# Altium schematic sheet 2_LDO.SchDoc: LDO
size A4; ApprovedBy: Alcatraz; CheckedBy: Alcatraz; Author: Alcatraz; CompanyName: DHNLAB; DrawnBy: Alcatraz; Engineer: Alcatraz; Organization: DHNLAB PVT LTD; Address1: DHANBAD; Address2: JHARKHAND; Address3: INDIA; Address4: ASIA; DocumentNumber: 2; Revision: 1.0; SheetNumber: 2; SheetTotal: 10; ProjectTitle: ESP8266-Deskop_Power
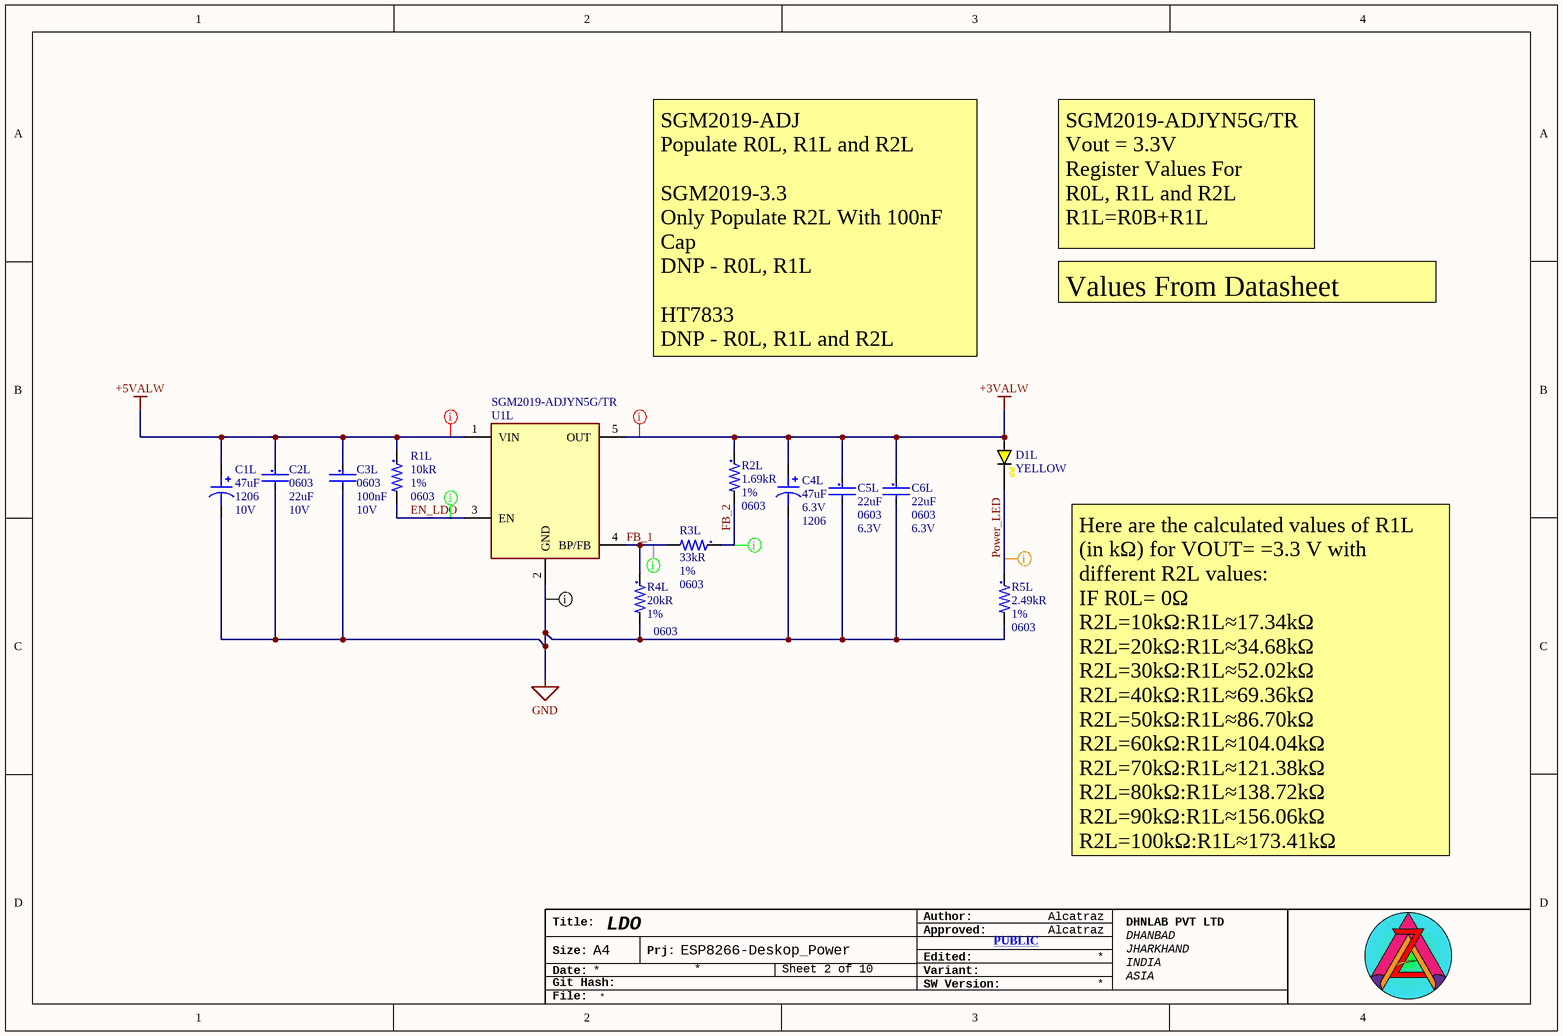
[diagram p0: 2_LDO.SchDoc]

## Parts
C1L  value 47uF  Case/Package: 1206  Voltage Rating (DC): 10V  [CAP POL 1206_3216-MFG]  (hidden comment: TCTAL1A476M8R)
C2L  value 22uF  Case/Package: 0603  Voltage Rating: 10V  [C0603-IPC_C_No_Silk]  (hidden comment: GRM188R61A226ME15D)
C3L  value 100nF  Case/Package: 0603  Voltage Rating: 10V  [C0603-IPC_C_No_Silk]  (hidden comment: C0603C104K8RACTU)
C4L  value 47uF  Voltage: 6.3V  Size: 1206  [CAP POL 1206_3216-MFG]  (hidden comment: T491A476M006AT)
C5L  value 22uF  Case/Package: 0603  Voltage Rating: 6.3V  [C0603-IPC_C_No_Silk]  (hidden comment: GRM188R60J226MEA0D)
C6L  value 22uF  Case/Package: 0603  Voltage Rating: 6.3V  [C0603-IPC_C_No_Silk]  (hidden comment: GRM188R60J226MEA0D)
D1L  YELLOW  [LED_0603_YELLOW]
R1L  value 10kR  Tolerance: 1%  Case/Package: 0603  [R0603-MFG]  (hidden comment: RC0603FR-0710KL)
R2L  value 1.69kR  Tolerance: 1%  Case/Package: 0603  [R0603-MFG]  (hidden comment: MCR03EZPFX1691)
R3L  value 33kR  Tolerance: 1%  Case/Package: 0603  [R0603-MFG]  (hidden comment: ERJ-3EKF3302V)
R4L  value 20kR  Tolerance: 1%  Case/Package: 0603  [R0603-MFG]  (hidden comment: CR0603-FX-2002ELF)
R5L  value 2.49kR  Tolerance: 1%  Case/Package: 0603  [R0603-MFG]  (hidden comment: MCR03EZPFX2491)
U1L  SGM2019-ADJYN5G/TR  [TSOT-23-5-IPC-A]

## Nets
+3VALW: C4L.1 C5L.1 C6L.1 D1L.2(A) R2L.1 U1L.5(OUT)
+5VALW: C1L.1 C2L.1 C3L.1 R1L.1 U1L.1(VIN)
GND: C1L.2 C2L.2 C3L.2 C4L.2 C5L.2 C6L.2 R4L.2 R5L.2 U1L.2(GND)
EN_LDO: R1L.2 U1L.3(EN)
FB_1: R3L.2 R4L.1 U1L.4(BP/FB)
FB_2: R2L.2 R3L.1
Power_LED: D1L.1(K) R5L.1

## Layout directives
net class GND; net class PowerRails_GND: GND
net class Power; net class PowerRails_LowVoltage_DC; net class Power_Signal: Power_LED
net class Digital_Signal_Low_Speed; net class Signal: EN_LDO, FB_1, FB_2
net class Power; net class PowerRails_LowVoltage_DC: +3VALW, +5VALW

## Notes on the sheet
- SGM2019-ADJYN5G/TR
  Vout = 3.3V
  Register Values For
  R0L, R1L and R2L
  R1L=R0B+R1L
- Values From Datasheet
- SGM2019-ADJ
  Populate R0L, R1L and R2L
  SGM2019-3.3
  Only Populate R2L With 100nF Cap
  DNP - R0L, R1L
  HT7833
  DNP - R0L, R1L and R2L
- Here are the calculated values of R1L (in kΩ) for VOUT= =3.3 V with different R2L values:
  IF R0L= 0Ω
  R2L=10kΩ:R1L≈17.34kΩ
  R2L=20kΩ:R1L≈34.68kΩ
  R2L=30kΩ:R1L≈52.02kΩ
  R2L=40kΩ:R1L≈69.36kΩ
  R2L=50kΩ:R1L≈86.70kΩ
  R2L=60kΩ:R1L≈104.04kΩ
  R2L=70kΩ:R1L≈121.38kΩ
  R2L=80kΩ:R1L≈138.72kΩ
  R2L=90kΩ:R1L≈156.06kΩ
  R2L=100kΩ:R1L≈173.41kΩ
- Title:
- Author:
- Approved:
- Size:
- Date:
- Git Hash:
- A4
- Prj:
- SW Version:
- Variant:
- Edited:
- PUBLIC
- File:

## Library data of the parts
C1L = 47uF_10V: Surface Mount Tantalum Capacitor, 47 uF, 10 V, ± 20%, -55 °C, 125 °C, 1206 [3216-12 Metric]; Manufacturer: Rohm; Supplier 1: Ameya360; RoHS: Yes; Category: Tantalum Capacitors; ComponentLink1URL: https://datasheet.ciiva.com/258/tct-al-258880.pdf?src-supplier=Digikey; ComponentLink1Description: https://datasheet.ciiva.com/258/tct-al-258880.pdf?src-supplier=Digikey; ComponentLink2URL: https://datasheet.ciiva.com/258/tct-al-258881.pdf?src-supplier=Digikey; ComponentLink2Description: https://datasheet.ciiva.com/258/tct-al-258881.pdf?src-supplier=Digikey; ComponentLink3URL: https://datasheet.ciiva.com/258/tct-al-258879.pdf?src-supplier=Digikey; ComponentLink3Description: https://datasheet.ciiva.com/258/tct-al-258879.pdf?src-supplier=Digikey; ComponentLink4URL: https://datasheet.ciiva.com/16394/tct-al-16394319.pdf?src-supplier=Future+Electronics; ComponentLink4Description: https://datasheet.ciiva.com/16394/tct-al-16394319.pdf?src-supplier=Future+Electronics; Manufacturer Part Number: TCTAL1A476M8R; Stock 1: 250; Pricing 1: 1=0.82, 10=0.622 (USD); Supplier Part Number 1: TCTAL1A476M8R; Mounting Technology: Surface Mount; Case Code (Metric): 3216; Case Code (Imperial): 1206; Min Operating Temperature: -55°C; Max Operating Temperature: 125°C; Tolerance: 20%; Packaging: Cut Tape; Voltage Rating: 10V; Series: TCT; Features: General Purpose; Construction: Flat; Length: 3.2mm; Height: 1.1mm; Depth: 1.6mm; Radiation Hardening: No; RoHS Compliant: Yes; Lead Free: Lead Free
C2L = 22uF_10V: Multilayer Ceramic Capacitor, 22 uF, 10 V, ± 20%, X5R, 0603 [1608 Metric]; Manufacturer: Murata; Supplier 1: Mouser; Manufacturer Part Number: GRM188R61A226ME15D; RoHS: Yes; Category: Ceramic Capacitors; Pricing 1: 1=0.2, 10=0.088, 50=0.088, 100=0.051, 1000=0.041, 10000=0.037 (USD); Mounting Technology: Surface Mount; Case Code (Imperial): 0603; Case Code (Metric): 1608; Min Operating Temperature: -55°C; Max Operating Temperature: 85°C; Packaging: Cut Tape; Dielectric: X5R; Package Quantity: 4000; Series: GRM; Termination: SMD/SMT; Voltage Rating (DC): 10V; Length: 1.6mm; Width: 0.8mm; Height: 0.8mm; RoHS Compliant: Yes; Lead Free: 5697LeadFree; ComponentLink1URL: https://datasheet.ciiva.com/46444/1769893-46444975.pdf?src-supplier=Element14; ComponentLink1Description: https://datasheet.ciiva.com/46444/1769893-46444975.pdf?src-supplier=Element14; Supplier Part Number 1: 81-GRM188R61A226ME5D; Tolerance: 20%; Stock 1: 596743; Material: Ceramic; Weight: 0.000222oz; Thickness: 0.039inch; Reach SVHC Compliant: No
C3L = 100nF_10V: Multilayer Ceramic Capacitor, 0.1 uF, 10 V, ± 10%, X7R, 0603 [1608 Metric]; Manufacturer: KEMET; Material: 4241ConductorMaterial; Dissipation Factor: 5%; Temperature Coefficient: 30ppm/°C; Supplier 1: Mouser; Manufacturer Part Number: C0603C104K8RACTU; RoHS: Yes; Category: Ceramic Capacitors; Pricing 1: 1=0.11, 10=0.075, 50=0.075, 100=0.036, 1000=0.021, 10000=0.017 (USD); Mounting Technology: Surface Mount,PCB; Case Code (Imperial): 0603; Case Code (Metric): 1608; Min Operating Temperature: -55°C; Max Operating Temperature: 125°C; Packaging: Tape and Reel; Dielectric: X7R; Package Quantity: 1; Series: C; Termination: SMD/SMT; Voltage Rating (DC): 10V; Length: 1.6mm; Width: 0.031inch; Height: 0.8mm; RoHS Compliant: Yes; Lead Free: 5697LeadFree; ComponentLink1URL: https://datasheet.ciiva.com/6093/1776114-6093269.pdf?src-supplier=Farnell; ComponentLink1Description: https://datasheet.ciiva.com/6093/1776114-6093269.pdf?src-supplier=Farnell; Supplier Part Number 1: 80-C0603C104K8R; Tolerance: 10%; Stock 1: 246409; Thickness: 0.034inch; Reach SVHC Compliant: No; Pins: 2; Dielectric Material: Ceramic; Voltage: 10V; Construction: Flat; Depth: 0.8mm; ComponentLink2URL: https://datasheet.ciiva.com/7823/kem-c1002-x7r-smd-7823989.pdf?src-supplier=Element14; ComponentLink2Description: https://datasheet.ciiva.com/7823/kem-c1002-x7r-smd-7823989.pdf?src-supplier=Element14; ComponentLink3URL: https://datasheet.ciiva.com/22693/1851736-22693967.pdf?src-supplier=Element14; ComponentLink3Description: https://datasheet.ciiva.com/22693/1851736-22693967.pdf?src-supplier=Element14; ComponentLink4URL: https://datasheet.ciiva.com/14589/70095383-14589402.pdf?src-supplier=Allied+Electronics; ComponentLink4Description: https://datasheet.ciiva.com/14589/70095383-14589402.pdf?src-supplier=Allied+Electronics; ComponentLink5URL: https://datasheet.ciiva.com/14593/70095383-14593978.pdf?src-supplier=Allied+Electronics; ComponentLink5Description: https://datasheet.ciiva.com/14593/70095383-14593978.pdf?src-supplier=Allied+Electronics; ComponentLink6URL: https://datasheet.ciiva.com/5419/kem-c1002-x7r-smd-357932-5419657.pdf?src-supplier=Mouser; ComponentLink6Description: https://datasheet.ciiva.com/5419/kem-c1002-x7r-smd-357932-5419657.pdf?src-supplier=Mouser; ComponentLink7URL: https://datasheet.ciiva.com/18192/getdatasheetpartid-91529-18192711.pdf?src-supplier=Verical; ComponentLink7Description: https://datasheet.ciiva.com/18192/getdatasheetpartid-91529-18192711.pdf?src-supplier=Verical; Lead Pitch: 0.7mm; Radiation Hardening: No
C4L = 47uF_6.3V: 47uF Solid MnO2 Tantalum Electrolytic Capacitor; 6.3 V dc +/-20%; T491 Series; Manufacturer: KEMET; Supplier 1: Mouser; RoHS: Yes; Category: Tantalum Capacitors; ComponentLink1URL: https://datasheet.ciiva.com/18096/getdatasheetpartid-132583-18096186.pdf?src-supplier=Verical; ComponentLink1Description: https://datasheet.ciiva.com/18096/getdatasheetpartid-132583-18096186.pdf?src-supplier=Verical; ComponentLink2URL: https://datasheet.ciiva.com/258/kem-t2005-t491-258163.pdf?src-supplier=Digikey; ComponentLink2Description: https://datasheet.ciiva.com/258/kem-t2005-t491-258163.pdf?src-supplier=Digikey; ComponentLink3URL: https://datasheet.ciiva.com/258/kem-t2005-t491-258164.pdf?src-supplier=Digikey; ComponentLink3Description: https://datasheet.ciiva.com/258/kem-t2005-t491-258164.pdf?src-supplier=Digikey; ComponentLink4URL: https://datasheet.ciiva.com/258/kem-t2005-t491-258165.pdf?src-supplier=Digikey; ComponentLink4Description: https://datasheet.ciiva.com/258/kem-t2005-t491-258165.pdf?src-supplier=Digikey; ComponentLink5URL: https://datasheet.ciiva.com/12883/kem-t2005-t491-12883464.pdf?src-supplier=Mouser; ComponentLink5Description: https://datasheet.ciiva.com/12883/kem-t2005-t491-12883464.pdf?src-supplier=Mouser; ComponentLink6URL: https://datasheet.ciiva.com/14103/t491serie-eng-tds-14103966.pdf?src-supplier=Distrelec; ComponentLink6Description: https://datasheet.ciiva.com/14103/t491serie-eng-tds-14103966.pdf?src-supplier=Distrelec; ComponentLink7URL: https://datasheet.ciiva.com/28561/kem-t2005-t491-28561180.pdf?src-supplier=Element14; ComponentLink7Description: https://datasheet.ciiva.com/28561/kem-t2005-t491-28561180.pdf?src-supplier=Element14; ComponentLink8URL: https://datasheet.ciiva.com/7851/1854511-7851173.pdf?src-supplier=Element14; ComponentLink8Description: https://datasheet.ciiva.com/7851/1854511-7851173.pdf?src-supplier=Element14; ComponentLink9URL: https://datasheet.ciiva.com/7851/1854511-7851174.pdf?src-supplier=Element14; ComponentLink9Description: https://datasheet.ciiva.com/7851/1854511-7851174.pdf?src-supplier=Element14; Manufacturer Part Number: T491A476M006AT; Stock 1: 52790; Pricing 1: 1=0.58, 10=0.394, 50=0.394, 100=0.259, 1000=0.172, 10000=0.139 (USD); Supplier Part Number 1: 80-T491A476M06
C5L C6L = 22uF_6.3V: Multilayer Ceramic Capacitor, 22 uF, 6.3 V, ± 20%, X5R, 0603 [1608 Metric]; Manufacturer: Murata; Material: 4241ConductorMaterial; Supplier 1: Mouser; Manufacturer Part Number: GRM188R60J226MEA0D; RoHS: Yes; Category: Ceramic Capacitors; Stock 1: 856547; Pricing 1: 1=0.2, 10=0.078, 50=0.078, 100=0.045, 1000=0.04, 10000=0.033 (USD); Mounting Technology: Surface Mount; Pins: 2NUMBER; Case Code (Metric): 1608; Weight: 0.000222oz; Min Operating Temperature: -55°C; Max Operating Temperature: 85°C; Tolerance: 20%; Series: GRM; Packaging: Tape and Reel; Dielectric: X5R; Voltage Rating (DC): 6.3V; Package Quantity: 1; Termination: SMD/SMT; Length: 0.063inch; Width: 0.031inch; Height: 0.8mm; Thickness: 0.039inch; RoHS Compliant: Yes; Reach SVHC Compliant: No; Lead Free: 5697LeadFree; ComponentLink1URL: https://datasheet.ciiva.com/29540/partnumbering-e-01-29540442.pdf?src-supplier=Digikey; ComponentLink1Description: https://datasheet.ciiva.com/29540/partnumbering-e-01-29540442.pdf?src-supplier=Digikey; ComponentLink2URL: https://datasheet.ciiva.com/29540/partnumbering-e-01-29540441.pdf?src-supplier=Digikey; ComponentLink2Description: https://datasheet.ciiva.com/29540/partnumbering-e-01-29540441.pdf?src-supplier=Digikey; ComponentLink3URL: https://datasheet.ciiva.com/29540/partnumbering-e-01-29540443.pdf?src-supplier=Digikey; ComponentLink3Description: https://datasheet.ciiva.com/29540/partnumbering-e-01-29540443.pdf?src-supplier=Digikey; Supplier Part Number 1: 81-GRM188R60J226ME0D; Case Code (Imperial): 0603
D1L = LED_0603_YELLOW: LED 0603 YELLOW SMD
R1L = 10K: SMD Chip Resistor, 10 kOhm, ± 1%, 100 mW, 0603 [1608 Metric], Thick Film, General Purpose; Manufacturer: Yageo; Power Rating: 100mW; Temperature Coefficient: 100ppm/°C; Voltage Rating (DC): 50V; Voltage Rating: 75V; Supplier 1: Future Electronics; Manufacturer Part Number: RC0603FR-0710KL; RoHS: Yes; Category: Chip SMD Resistors; Stock 1: 44660000; Pricing 1: 5000=0.0015, 50000=0.0014, 150000=0.0014, 375000=0.0013, 1000000=0.0012 (USD); Case Code (Imperial): 0603; Case Code (Metric): 1608; Min Operating Temperature: -55°C; Max Operating Temperature: 155°C; Packaging: Tape and Reel; Number of Terminations: 2; Max Power Dissipation: 100mW; Features: Moisture Resistant; Series: RC; Lead Free: 5697LeadFree; RoHS Compliant: Yes; Supplier Part Number 1: 4023214; Length: 1.6mm; Width: 0.8mm; Height: 0.45mm; Pins: 2; Weight: 7.1E-05oz; Resistance Tolerance: 1%; Termination: SMD/SMT; Resistor Type: Thick Film; Construction: Rectangular; Depth: 0.8mm; Lead Pitch: 0.3mm; Reach SVHC Compliant: No; Military Standard: Not
R2L = 1.69K: Surface Mount Thick Film Chip Resistor 0603 Case 1.69K Ohms 1% Tolerance 100 PPM; Manufacturer: Rohm; Power Rating: 100mW; Temperature Coefficient: 100ppm/°C; Voltage Rating (DC): 50V; Supplier 1: Quest; Manufacturer Part Number: MCR03EZPFX1691; RoHS: Yes; Category: Chip SMD Resistors; Stock 1: 11347; Pricing 1: 1=0.0232, 217=0.0145, 1380=0.0087, 5748=0.0044 (USD); Case Code (Imperial): 0603; Case Code (Metric): 1608; Min Operating Temperature: -55°C; Max Operating Temperature: 155°C; Packaging: Cut Tape; Number of Terminations: 2; Max Power Dissipation: 100mW; Features: Automotive AEC-Q200; Series: MCR03; Lead Free: Lead Free; RoHS Compliant: Yes; Supplier Part Number 1: MCR03EZPFX1691; Package Quantity: 1; Length: 0.063inch; Width: 0.031inch; Height: 0.022inch; Mounting Technology: Surface Mount; ComponentLink1URL: http://rohmfs.rohm.com/en/products/databook/datasheet/passive/resistor/chip_resistor/mcr.pdf?src-supplier=Avnet; ComponentLink1Description: http://rohmfs.rohm.com/en/products/databook/datasheet/passive/resistor/chip_resistor/mcr.pdf?src-supplier=Avnet; ComponentLink2URL: http://www.rohm.com/web/global/datasheet/MCR03EZPFX/mcr-e?src-supplier=Digikey; ComponentLink2Description: http://www.rohm.com/web/global/datasheet/MCR03EZPFX/mcr-e?src-supplier=Digikey
R3L = 33K: Res Thick Film 0603 33K Ohm 1% 0.1W(1/10W) ±100ppm/C Pad SMD Automotive T/R; Manufacturer: Panasonic; Power Rating: 100mW; Temperature Coefficient: 100ppm/°C; Voltage Rating (DC): 75V; Supplier 1: Onlinecomponents.com; Manufacturer Part Number: ERJ-3EKF3302V; RoHS: Yes; Category: Chip SMD Resistors; Stock 1: 350000; Pricing 1: 5000=0.0041, 10000=0.0039, 20000=0.0037, 40000=0.0036, 50000=0.0035 (USD); Case Code (Imperial): 0603; Case Code (Metric): 1608; Min Operating Temperature: -55°C; Max Operating Temperature: 155°C; Packaging: Tape and Reel; Number of Terminations: 2; Max Power Dissipation: 100mW; Features: Automotive AEC-Q200; Series: ERJ; Lead Free: 5697LeadFree; RoHS Compliant: Yes; Supplier Part Number 1: ERJ3EKF3302V; Mounting Technology: Surface Mount; Contact Plating: Tin; Package Quantity: 1; Length: 1.6mm; Width: 0.8mm; Height: 0.022inch; Pins: 2; Voltage Rating: 75V; Termination: SMD/SMT; Construction: Rectangular; Resistor Type: Thick Film; Resistance Tolerance: 1%; Depth: 0.8mm; Radiation Hardening: No; Military Standard: Not; Reach SVHC Compliant: No
R4L = 20K: SMD Chip Resistor, 20 kOhm, ± 1%, 100 mW, 0603 [1608 Metric], Thick Film, General Purpose; Manufacturer: Bourns; Power Rating: 100mW; Temperature Coefficient: 100ppm/°C; Voltage Rating (DC): 50V; Supplier 1: Onlinecomponents.com; Manufacturer Part Number: CR0603-FX-2002ELF; RoHS: Yes; Category: Chip SMD Resistors; Stock 1: 20000; Pricing 1: 20000=0.0014, 40000=0.0013, 80000=0.0013, 160000=0.0012 (USD); Case Code (Imperial): 0603; Case Code (Metric): 1608; Min Operating Temperature: -55°C; Max Operating Temperature: 155°C; Packaging: Tape and Reel; Number of Terminations: 2; Max Power Dissipation: 100mW; Features: Moisture Resistant; Series: CR0603; RoHS Compliant: Yes; ComponentLink1URL: https://datasheet.ciiva.com/11809/0900766b80fcdb72-11809666.pdf?src-supplier=Rs; ComponentLink1Description: https://datasheet.ciiva.com/11809/0900766b80fcdb72-11809666.pdf?src-supplier=Rs; ComponentLink2URL: https://datasheet.ciiva.com/9121/chpreztr-9121928.pdf?src-supplier=Avnet; ComponentLink2Description: https://datasheet.ciiva.com/9121/chpreztr-9121928.pdf?src-supplier=Avnet; Supplier Part Number 1: CR0603-FX-2002ELF; Mounting Technology: Surface Mount; Contact Plating: Tin; Package Quantity: 1; Length: 1.6mm; Width: 0.8mm; Height: 0.45mm; Voltage Rating: 50V; Resistor Type: Thick Film; Termination: SMD/SMT; Resistance Tolerance: 1%; Technology: THICK FILM; Depth: 0.8mm; Thickness: 457um; Radiation Hardening: No; Reach SVHC Compliant: No
R5L = 2.49K: Res Thick Film 0603 2.49K Ohm 1% 1/10W ±100ppm/°C Molded SMD SMD Paper T/R; Manufacturer: Rohm; Power Rating: 100mW; Voltage Rating (DC): 50V; Supplier 1: One Stop Electro; Manufacturer Part Number: MCR03EZPFX2491; RoHS: Yes; Category: Chip SMD Resistors; Stock 1: 683; Pricing 1: 1=0.036, 10=0.031, 100=0.031, 1000=0.028 (USD); Case Code (Imperial): 0603; Case Code (Metric): 1608; Min Operating Temperature: -55°C; Max Operating Temperature: 155°C; Packaging: Cut Tape; Number of Terminations: 2; Temperature Coefficient: 100ppm/°C; Max Power Dissipation: 100mW; Features: Automotive AEC-Q200; Series: MCR03; Lead Free: Lead Free; RoHS Compliant: Yes; ComponentLink1URL: https://datasheet.ciiva.com/2520/mcr-2520347.pdf?src-supplier=Digikey; ComponentLink1Description: https://datasheet.ciiva.com/2520/mcr-2520347.pdf?src-supplier=Digikey; ComponentLink2URL: https://datasheet.ciiva.com/2520/mcr-2520348.pdf?src-supplier=Digikey; ComponentLink2Description: https://datasheet.ciiva.com/2520/mcr-2520348.pdf?src-supplier=Digikey; ComponentLink3URL: https://datasheet.ciiva.com/2520/mcr-2520349.pdf?src-supplier=Digikey; ComponentLink3Description: https://datasheet.ciiva.com/2520/mcr-2520349.pdf?src-supplier=Digikey; ComponentLink4URL: https://datasheet.ciiva.com/16203/mcr03ezpd-16203167.pdf?src-supplier=Future+Electronics; ComponentLink4Description: https://datasheet.ciiva.com/16203/mcr03ezpd-16203167.pdf?src-supplier=Future+Electronics; Supplier Part Number 1: 53268691; Mounting Technology: Surface Mount; Contact Plating: Tin; Package Quantity: 1; Length: 0.063inch; Width: 0.031inch; Height: 0.022inch
U1L = SGM2019-ADJYN5G/TR: LDO U-Reg Adj 0, 3A SOT23-5; Manufacturer: SG Micro; Supplier 1: Sourcengine; Supplier Part Number 1: SGM2019-ADJYN5GTR-112944978; Manufacturer Part Number: SGM2019-ADJYN5G/TR; RoHS: No; Category: LDO; Stock 1: 6915